# EAGLE schematic synth (EAGLE 6.3)
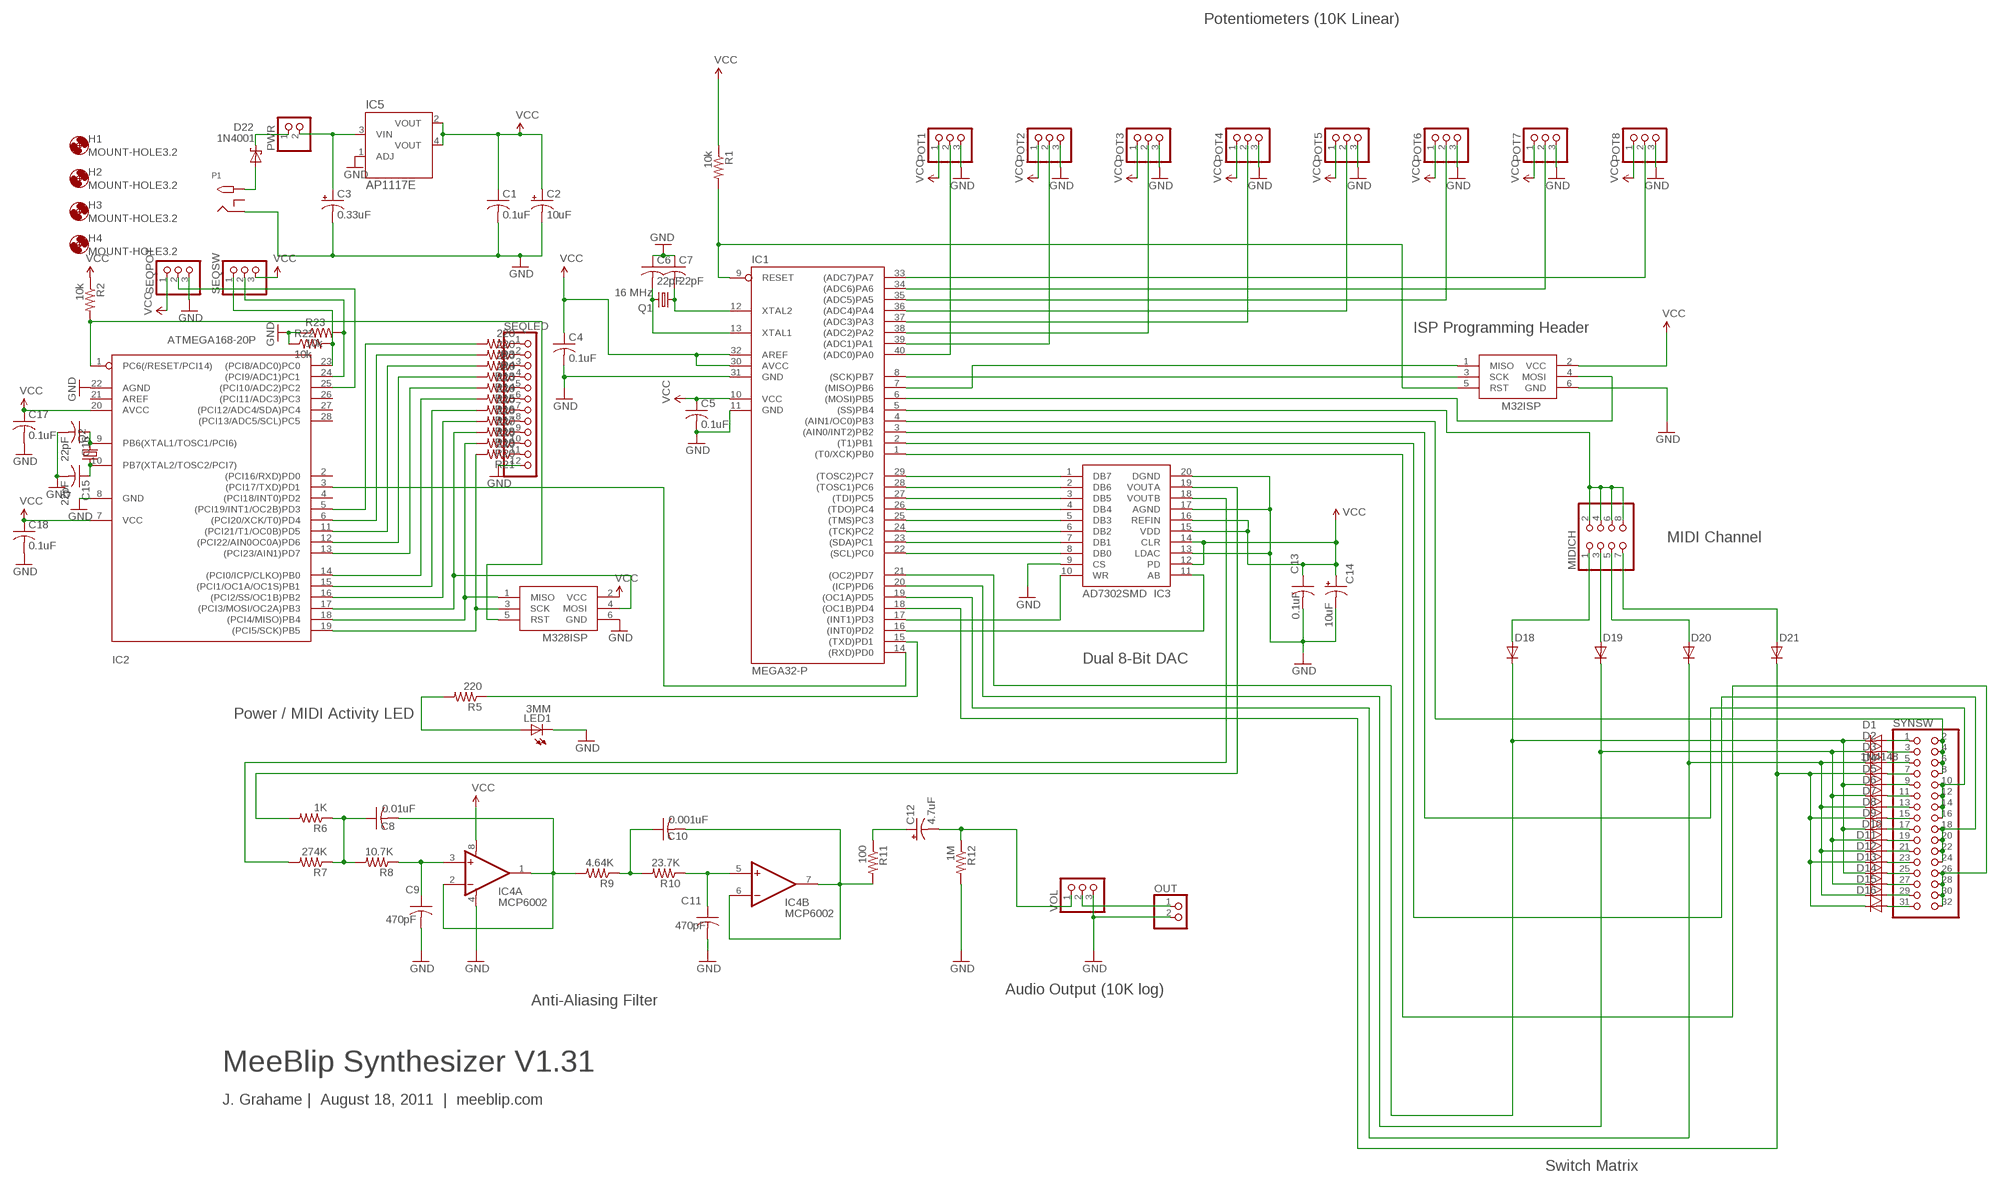
[diagram p0: schematic, sheet 1]

## Parts
C1  0.1uF  C-USC0805K  [C0805K]
C2  10uF  CPOL-USE2-5  [E2-5]
C3  0.33uF  CPOL-USE2-5  [E2-5]
C4  0.1uF  C-USC0805K  [C0805K]
C5  0.1uF  C-USC0805K  [C0805K]
C6  22pF  C-USC0805K  [C0805K]
C7  22pF  C-USC0805K  [C0805K]
C8  0.01uF  C-USC0805K  [C0805K]
C9  470pF  C-USC0805K  [C0805K]
C10  0.001uF  C-USC0805K  [C0805K]
C11  470pF  C-USC0805K  [C0805K]
C12  4.7uF  CPOL-USE2-5  [E2-5]
C13  0.1uF  C-USC0805K  [C0805K]
C14  10uF  CPOL-USE2-5  [E2-5]
C15  22pF  C-USC0805K  [C0805K]
C16  22pF  C-USC0805K  [C0805K]
C17  0.1uF  C-USC0805K  [C0805K]
C18  0.1uF  C-USC0805K  [C0805K]
D1  1N4148  DIODESOD-123  [SOD-123]
D2  1N4148  DIODESOD-123  [SOD-123]
D3  1N4148  DIODESOD-123  [SOD-123]
D4  1N4148  DIODESOD-123  [SOD-123]
D5  1N4148  DIODESOD-123  [SOD-123]
D6  1N4148  DIODESOD-123  [SOD-123]
D7  1N4148  DIODESOD-123  [SOD-123]
D8  1N4148  DIODESOD-123  [SOD-123]
D9  1N4148  DIODESOD-123  [SOD-123]
D10  1N4148  DIODESOD-123  [SOD-123]
D11  1N4148  DIODESOD-123  [SOD-123]
D12  1N4148  DIODESOD-123  [SOD-123]
D13  1N4148  DIODESOD-123  [SOD-123]
D14  1N4148  DIODESOD-123  [SOD-123]
D15  1N4148  DIODESOD-123  [SOD-123]
D16  1N4148  DIODESOD-123  [SOD-123]
D18  1N4148  DIODESOD-123  [SOD-123]
D19  1N4148  DIODESOD-123  [SOD-123]
D20  1N4148  DIODESOD-123  [SOD-123]
D21  1N4148  DIODESOD-123  [SOD-123]
D22  1N4001  SCHOTTKY-DIODEDO41-7  [DO41-7]
H1  MOUNT-HOLE3.2  [3,2]
H2  MOUNT-HOLE3.2  [3,2]
H3  MOUNT-HOLE3.2  [3,2]
H4  MOUNT-HOLE3.2  [3,2]
IC1  MEGA32-P  [DIL40]
IC2  ATMEGA168-20P  [DIL28-3]
IC3  AD7302SMD  [TSSOP20]
IC4  MCP6002  [DIL08]
IC5  AP1117E  [SOT223-3]
LED1  3MM  LED3MM  [LED3MM]
M32ISP  AVRISP-6  [AVRISP]
M328ISP  AVRISP-6  [AVRISP]
MIDICH  PINHD-2X4  [2X04]
OUT  PINHD-1X2  [1X02]
P1  2.1MMJACKTHM  [PJ-102A]
POT1  PINHD-1X3  [1X03]
POT2  PINHD-1X3  [1X03]
POT3  PINHD-1X3  [1X03]
POT4  PINHD-1X3  [1X03]
POT5  PINHD-1X3  [1X03]
POT6  PINHD-1X3  [1X03]
POT7  PINHD-1X3  [1X03]
POT8  PINHD-1X3  [1X03]
PWR  PINHD-1X2  [1X02]
Q1  16 MHz  CRYSTALHC49U-V  [HC49U-V]
Q2  CRYSTALHC49U-V  [HC49U-V]
R1  10k  R-US_R0805  [R0805]
R2  10k  R-US_R0805  [R0805]
R3  220  R-US_R0805  [R0805]
R4  220  R-US_R0805  [R0805]
R5  220  R-US_R0805  [R0805]
R6  1K  R-US_R0805  [R0805]
R7  274K  R-US_R0805  [R0805]
R8  10.7K  R-US_R0805  [R0805]
R9  4.64K  R-US_R0805  [R0805]
R10  23.7K  R-US_R0805  [R0805]
R11  100  R-US_R0805  [R0805]
R12  1M  R-US_R0805  [R0805]
R13  220  R-US_R0805  [R0805]
R14  220  R-US_R0805  [R0805]
R15  220  R-US_R0805  [R0805]
R16  220  R-US_R0805  [R0805]
R17  220  R-US_R0805  [R0805]
R18  220  R-US_R0805  [R0805]
R19  220  R-US_R0805  [R0805]
R20  220  R-US_R0805  [R0805]
R21  220  R-US_R0805  [R0805]
R22  10k  R-US_R0805  [R0805]
R23  10k  R-US_R0805  [R0805]
SEQLED  PINHD-1X12  [1X12]
SEQPOT  PINHD-1X3  [1X03]
SEQSW  PINHD-1X3  [1X03]
SYNSW  PINHD-2X16  [2X16]
VOL  PINHD-1X3  [1X03]

## Nets
GND: C1.2 C2.- C3.- C4.2 C5.2 C6.1 C7.1 C9.2 C11.2 C13.2 C14.- C15.2 C16.2 C17.2 C18.2 IC1.11(GND) IC1.31(GND) IC2.8(GND) IC2.22(AGND) IC3.9(CS) IC3.13(LDAC) IC3.17(AGND) IC3.20(DGND) IC4.4(A:V-) IC5.1(ADJ) LED1.K(C) M32ISP.6(GND) M328ISP.6(GND) OUT.2 P1.RING POT1.3 POT2.3 POT3.3 POT4.3 POT5.3 POT6.3 POT7.3 POT8.3 R12.2 R22.1 R23.1 SEQLED.12 SEQPOT.3 VOL.3
N$1: C7.2 IC1.12(XTAL2) Q1.1
N$2: C6.2 IC1.13(XTAL1) Q1.2
N$3: IC1.6((MOSI)PB5) M32ISP.4(MOSI)
N$4: IC1.8((SCK)PB7) M32ISP.3(SCK)
N$5: IC1.7((MISO)PB6) M32ISP.1(MISO)
N$6: IC1.40((ADC0)PA0) POT1.2
N$7: IC1.39((ADC1)PA1) POT2.2
N$8: IC1.9(RESET) M32ISP.5(RST) R1.2
N$9: IC1.38((ADC2)PA2) POT3.2
N$10: IC1.37((ADC3)PA3) POT4.2
N$11: IC1.15((TXD)PD1) R5.1
N$12: IC1.36((ADC4)PA4) POT5.2
N$13: LED1.A R5.2
N$14: IC1.35((ADC5)PA5) POT6.2
N$15: IC1.34((ADC6)PA6) POT7.2
N$16: IC1.33((ADC7)PA7) POT8.2
N$17: OUT.1 VOL.2
N$18: D1.A SYNSW.1
N$19: IC3.19(VOUTA) R6.2
N$20: IC2.5((PCI19/INT1/OC2B)PD3) R3.2
N$21: C12.+ R11.1
N$22: IC1.5((SS)PB4) MIDICH.2 MIDICH.4 MIDICH.6 MIDICH.8
N$23: C12.- R12.1 VOL.1
N$24: D2.A SYNSW.3
N$25: D22.A P1.TIP
N$26: IC1.3((AIN0/INT2)PB2) SYNSW.10 SYNSW.12 SYNSW.14 SYNSW.16
N$27: C3.+ IC5.3(VIN) PWR.2
N$28: D3.A SYNSW.5
N$29: D4.A SYNSW.7
N$30: C15.1 IC2.10(PB7(XTAL2/TOSC2/PCI7)) Q2.1
N$31: D5.A SYNSW.9
N$32: D6.A SYNSW.11
N$33: C16.1 IC2.9(PB6(XTAL1/TOSC1/PCI6)) Q2.2
N$34: IC1.22((SCL)PC0) IC3.8(DB0)
N$35: IC1.23((SDA)PC1) IC3.7(DB1)
N$36: IC1.24((TCK)PC2) IC3.6(DB2)
N$37: IC1.25((TMS)PC3) IC3.5(DB3)
N$38: IC1.26((TDO)PC4) IC3.4(DB4)
N$39: IC1.27((TDI)PC5) IC3.3(DB5)
N$40: IC1.28((TOSC1)PC6) IC3.2(DB6)
N$41: IC1.29((TOSC2)PC7) IC3.1(DB7)
N$42: D22.C PWR.1
N$43: IC1.17((INT1)PD3) IC3.10(WR)
N$44: D7.A SYNSW.13
N$45: R21.1 SEQLED.11
N$46: IC2.19((PCI5/SCK)PB5) M328ISP.3(SCK) R21.2
N$47: IC1.14((RXD)PD0) IC2.3((PCI17/TXD)PD1)
N$48: IC1.16((INT0)PD2) IC3.11(AB)
N$49: D8.A SYNSW.15
N$50: IC2.18((PCI4/MISO)PB4) M328ISP.1(MISO) R20.2
N$51: D9.A SYNSW.17
N$52: D10.A SYNSW.19
N$53: D11.A SYNSW.21
N$54: D12.A SYNSW.23
N$55: D13.A SYNSW.25
N$56: D14.A SYNSW.27
N$57: IC2.1(PC6(/RESET/PCI14)) M328ISP.5(RST) R2.2
N$58: R3.1 SEQLED.1
N$59: D18.A MIDICH.1
N$60: D15.A SYNSW.29
N$61: R4.1 SEQLED.2
N$62: D1.C D5.C D9.C D13.C D18.C IC1.21((OC2)PD7)
N$63: D19.A MIDICH.3
N$64: D16.A SYNSW.31
N$65: D20.A MIDICH.5
N$66: D21.A MIDICH.7
N$67: R13.1 SEQLED.3
N$68: R14.1 SEQLED.4
N$69: C8.1 R6.1 R7.1 R8.2
N$70: IC3.18(VOUTB) R7.2
N$71: C9.1 IC4.3(A:+IN) R8.1
N$72: D4.C D8.C D12.C D16.C D21.C IC1.18((OC1B)PD4)
N$73: C10.1 R9.1 R10.2
N$74: C11.1 IC4.5(B:+IN) R10.1
N$75: C10.2 IC4.6(B:-IN) IC4.7(B:OUT) R11.2
N$76: R15.1 SEQLED.5
N$77: C8.2 IC4.1(A:OUT) IC4.2(A:-IN) R9.2
N$78: R16.1 SEQLED.6
N$79: R17.1 SEQLED.7
N$80: R18.1 SEQLED.8
N$81: R19.1 SEQLED.9
N$82: R20.1 SEQLED.10
N$83: IC2.6((PCI20/XCK/T0)PD4) R4.2
N$84: IC2.11((PCI21/T1/OC0B)PD5) R13.2
N$85: IC2.12((PCI22/AIN0OC0A)PD6) R14.2
N$86: IC2.13((PCI23/AIN1)PD7) R15.2
N$87: IC2.14((PCI0/ICP/CLKO)PB0) R16.2
N$88: IC2.15((PCI1/OC1A/OC1S)PB1) R17.2
N$89: IC2.16((PCI2/SS/OC1B)PB2) R18.2
N$90: IC2.17((PCI3/MOSI/OC2A)PB3) M328ISP.4(MOSI) R19.2
N$91: IC2.25((PCI10/ADC2)PC2) SEQPOT.2
N$92: IC2.24((PCI9/ADC1)PC1) R23.2 SEQSW.2
N$93: IC2.23((PCI8/ADC0)PC0) R22.2 SEQSW.1
S1: IC1.1((T0/XCK)PB0) SYNSW.26 SYNSW.28 SYNSW.30 SYNSW.32
S3: IC1.2((T1)PB1) SYNSW.18 SYNSW.20 SYNSW.22 SYNSW.24
S7: D3.C D7.C D11.C D15.C D20.C IC1.19((OC1A)PD5)
S8: IC1.4((AIN1/OC0)PB3) SYNSW.2 SYNSW.4 SYNSW.6 SYNSW.8
S10A: D2.C D6.C D10.C D14.C D19.C IC1.20((ICP)PD6)
VCC: C1.1 C2.+ C4.1 C5.1 C13.1 C14.+ C17.1 C18.1 IC1.10(VCC) IC1.30(AVCC) IC1.32(AREF) IC2.7(VCC) IC2.20(AVCC) IC3.12(PD) IC3.14(CLR) IC3.15(VDD) IC3.16(REFIN) IC4.8(A:V+) IC5.2(VOUT) IC5.4(VOUT) M32ISP.2(VCC) M328ISP.2(VCC) POT1.1 POT2.1 POT3.1 POT4.1 POT5.1 POT6.1 POT7.1 POT8.1 R1.1 R2.1 SEQPOT.1 SEQSW.3
Unconnected: IC2.2((PCI16/RXD)PD0) IC2.4((PCI18/INT0)PD2) IC2.21(AREF) IC2.26((PCI11/ADC3)PC3) IC2.27((PCI12/ADC4/SDA)PC4) IC2.28((PCI13/ADC5/SCL)PC5) P1.RING_SW

## Notes on the sheet
- Potentiometers (10K Linear)
- ISP Programming Header
- MIDI Channel
- Dual 8-Bit DAC
- Power / MIDI Activity LED
- Audio Output (10K log)
- Anti-Aliasing Filter
- MeeBlip Synthesizer V1.31
- J. Grahame |  August 18, 2011  |  meeblip.com
- Switch Matrix

## Library data of the parts
C1 C4-C11 C13 C15-C18 = adafruit:C-US: CAPACITOR, American symbol
C2 C3 C12 C14 = adafruit:CPOL-US: POLARIZED CAPACITOR, American symbol
D1-D16 D18-D21 = adafruit:DIODE: Diode SMADIODE - SMA Surface Mount Package 20V 1A Schottky Diode Digikey: 641-1014-6-ND DO-1N4148 - Through Hole Small Current Diode SOD-123 20V 1 A (.5mV Vf) Schottky Diode - Digikey: MBRX120TPMSCT-ND SOD-323 10V 570mA (.38mV Vf, 3ns) Schottky Diode - Digikey: ZLLS410CT-ND SOD-523 30V 30mA Schottky Diode (RB751S-40TE61) - Digikey: RB751S-40TE61CT-ND SOT23-R/W - SOT23 Package (R = Solder Paste/Reflow Ovens, W = Hand-Soldering) BAT54Film 40V 300mA - Digikey: 497-7162-1-ND
D22 = adafruit:SCHOTTKY-DIODE: Schottky Diode
H1-H4 = holes:MOUNT-HOLE: MOUNTING HOLE with drill center marker
IC1 = meeblip:MEGA32-P: MICROCONTROLLER 32 Kbytes FLASH 2 Kbytes SRAM 1 Kbytes EEPROM USART 8-channel 10 bit ADC Source: www.atmel.com .. doc2503.pdf
IC2 = adafruit:ATMEGA168*P: MICROCONTROLLER 16 kBytes FLASH 1 kBytes SRAM 512 Bytes EEPROM USART 8-channel 10 bit ADC
IC3 = SparkFun:AD7302: AD7302
IC4 = meeblip:MCP6002: Dual Op Amp
IC5 = Diodes Inc:AP1117: AP1117 1A Low Dropout Positive Adjustable or Fixed-Mode Regualtor Source: AP1117 Datasheet <http://www.diodes.com/datasheets/AP1117.pdf>
LED1 = meeblip:LED: LED OSRAM: - CHIPLED LG R971, LG N971, LY N971, LG Q971, LY Q971, LO R971, LY R971 LH N974, LH R974 LS Q976, LO Q976, LY Q976 LO Q996 - Hyper CHIPLED LW Q18S LB Q993, LB Q99A, LB R99A - SideLED LS A670, LO A670, LY A670, LG A670, LP A670 LB A673, LV A673, LT A673, LW A673 LH A674 LY A675 LS A676, LA A676, LO A676, LY A676, LW A676 LS A679, LY A679, LG A679 - Hyper Micro SIDELED® LS Y876, LA Y876, LO Y876, LY Y876 LT Y87S - SmartLED LW L88C, LW L88S LB L89C, LB L89S, LG L890 LS L89K, LO L89K, LY L89K LS L896, LA L896, LO L896, LY L896 - TOPLED LS T670, LO T670, LY T670, LG T670, LP T670 LSG T670, LSP T670, LSY T670, LOP T670, LYG T670 LG T671, LOG T671, LSG T671 LB T673, LV T673, LT T673, LW T673 LH T674 LS T676, LA T676, LO T676, LY T676, LB T676, LH T676, LSB T676, LW T676 LB T67C, LV T67C, LT T67C, LS T67K, LO T67K, LY T67K, LW E67C LS E67B, LA E67B, LO E67B, LY E67B, LB E67C, LV E67C, LT E67C LW T67C LS T679, LY T679, LG T679 LS T770, LO T770, LY T770, LG T770, LP T770 LB T773, LV T773, LT T773, LW T773 LH T774 LS E675, LA E675, LY E675, LS T675 LS T776, LA T776, LO T776, LY T776, LB T776 LHGB T686 LT T68C, LB T68C - Hyper Mini TOPLED® LB M676 - Mini TOPLED Santana® LG M470 LS M47K, LO M47K, LY M47K Source: http://www.osram.convergy.de LUXEON: - LUMILED® LXK2-PW12-R00, LXK2-PW12-S00, LXK2-PW14-U00, LXK2-PW14-V00 LXK2-PM12-R00, LXK2-PM12-S00, LXK2-PM14-U00 LXK2-PE12-Q00, LXK2-PE12-R00, LXK2-PE12-S00, LXK2-PE14-T00, LXK2-PE14-U00 LXK2-PB12-K00, LXK2-PB12-L00, LXK2-PB12-M00, LXK2-PB14-N00, LXK2-PB14-P00, LXK2-PB14-Q00 LXK2-PR12-L00, LXK2-PR12-M00, LXK2-PR14-Q00, LXK2-PR14-R00 LXK2-PD12-Q00, LXK2-PD12-R00, LXK2-PD12-S00 LXK2-PH12-R00, LXK2-PH12-S00 LXK2-PL12-P00, LXK2-PL12-Q00, LXK2-PL12-R00 Source: www.luxeon.com KINGBRIGHT: KA-3528ASYC Source: www.kingbright.com
M32ISP M328ISP = icsp:AVRISP: AVR ISP HEADER Standard 6 pin header for AVR programming
MIDICH = pinhead:PINHD-2X4: PIN HEADER
OUT PWR = pinhead:PINHD-1X2: PIN HEADER
P1 = adafruit:2.1MMJACK: 2.1mm x 5.5mm THM DC jack with internal switch. Digikey part #PJ-102A, 4UCON part #05537 2.1mm x 5.5mm SMT DC jack with internal switch. Digikey part #PJ-002A-SMT, 4UCON part #03267 By microbuilder.eu & adafruit.com
POT1-POT8 SEQPOT SEQSW VOL = pinhead:PINHD-1X3: PIN HEADER
Q1 Q2 = crystal:CRYSTAL: CRYSTAL; OC_FARNELL: 1666969; OC_NEWARK: unknown
R1-R23 = adafruit:R-US_: RESISTOR, American symbol
SEQLED = pinhead:PINHD-1X12: PIN HEADER
SYNSW = pinhead:PINHD-2X16: PIN HEADER